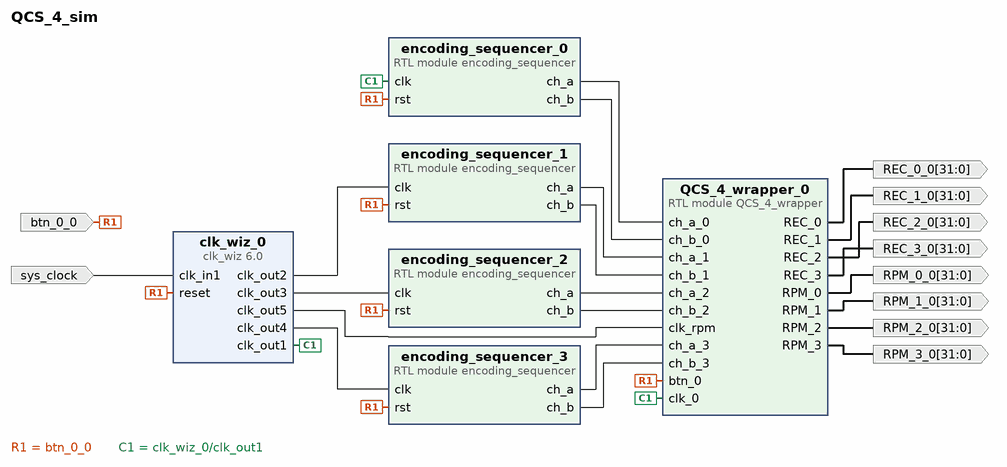
[diagram p0: block diagram of the top level]
# Vivado block design QCS_4_sim, xc7a35ticsg324-1L, Vivado 2023.1
create_bd_design QCS_4_sim

create_bd_port -dir O -from 31 -to 0 REC_0_0
create_bd_port -dir O -from 31 -to 0 REC_1_0
create_bd_port -dir O -from 31 -to 0 REC_2_0
create_bd_port -dir O -from 31 -to 0 REC_3_0
create_bd_port -dir O -from 31 -to 0 RPM_0_0
create_bd_port -dir O -from 31 -to 0 RPM_1_0
create_bd_port -dir O -from 31 -to 0 RPM_2_0
create_bd_port -dir O -from 31 -to 0 RPM_3_0
create_bd_port -dir I -type clk sys_clock
set_property -dict {CONFIG.FREQ_HZ 100000000 CONFIG.PHASE 0.0} [get_bd_ports sys_clock]
create_bd_port -dir I btn_0_0

create_bd_cell -type ip -vlnv xilinx.com:ip:clk_wiz:6.0 clk_wiz_0
set_property -dict [list \
  CONFIG.CLKOUT1_DRIVES BUFG \
  CONFIG.CLKOUT1_JITTER 115.831 \
  CONFIG.CLKOUT1_PHASE_ERROR 87.180 \
  CONFIG.CLKOUT2_DRIVES BUFG \
  CONFIG.CLKOUT2_JITTER 112.035 \
  CONFIG.CLKOUT2_PHASE_ERROR 87.180 \
  CONFIG.CLKOUT2_REQUESTED_OUT_FREQ 120 \
  CONFIG.CLKOUT2_USED true \
  CONFIG.CLKOUT3_DRIVES BUFG \
  CONFIG.CLKOUT3_JITTER 107.567 \
  CONFIG.CLKOUT3_PHASE_ERROR 87.180 \
  CONFIG.CLKOUT3_REQUESTED_OUT_FREQ 150 \
  CONFIG.CLKOUT3_USED true \
  CONFIG.CLKOUT4_DRIVES BUFG \
  CONFIG.CLKOUT4_JITTER 102.086 \
  CONFIG.CLKOUT4_PHASE_ERROR 87.180 \
  CONFIG.CLKOUT4_REQUESTED_OUT_FREQ 200 \
  CONFIG.CLKOUT4_USED true \
  CONFIG.CLKOUT5_DRIVES BUFG \
  CONFIG.CLKOUT5_JITTER 90.074 \
  CONFIG.CLKOUT5_PHASE_ERROR 87.180 \
  CONFIG.CLKOUT5_REQUESTED_OUT_FREQ 400 \
  CONFIG.CLKOUT5_USED true \
  CONFIG.CLKOUT6_DRIVES BUFG \
  CONFIG.CLKOUT7_DRIVES BUFG \
  CONFIG.CLK_IN1_BOARD_INTERFACE sys_clock \
  CONFIG.MMCM_BANDWIDTH OPTIMIZED \
  CONFIG.MMCM_CLKFBOUT_MULT_F 12 \
  CONFIG.MMCM_CLKOUT0_DIVIDE_F 12 \
  CONFIG.MMCM_CLKOUT1_DIVIDE 10 \
  CONFIG.MMCM_CLKOUT2_DIVIDE 8 \
  CONFIG.MMCM_CLKOUT3_DIVIDE 6 \
  CONFIG.MMCM_CLKOUT4_DIVIDE 3 \
  CONFIG.MMCM_COMPENSATION ZHOLD \
  CONFIG.NUM_OUT_CLKS 5 \
  CONFIG.OVERRIDE_MMCM false \
  CONFIG.PRIMITIVE PLL \
  CONFIG.RESET_BOARD_INTERFACE reset \
  CONFIG.RESET_PORT reset \
  CONFIG.RESET_TYPE ACTIVE_HIGH \
  CONFIG.USE_BOARD_FLOW true \
  CONFIG.USE_LOCKED false \
  CONFIG.USE_RESET true \
] [get_bd_cells clk_wiz_0]
create_bd_cell -type module -reference encoding_sequencer encoding_sequencer_0
create_bd_cell -type module -reference encoding_sequencer encoding_sequencer_1
create_bd_cell -type module -reference encoding_sequencer encoding_sequencer_2
create_bd_cell -type module -reference encoding_sequencer encoding_sequencer_3
create_bd_cell -type module -reference QCS_4_wrapper QCS_4_wrapper_0

# ---- connections ----

connect_bd_net [get_bd_pins QCS_4_wrapper_0/REC_0] [get_bd_ports REC_0_0]
connect_bd_net [get_bd_pins QCS_4_wrapper_0/REC_1] [get_bd_ports REC_1_0]
connect_bd_net [get_bd_pins QCS_4_wrapper_0/REC_2] [get_bd_ports REC_2_0]
connect_bd_net [get_bd_pins QCS_4_wrapper_0/REC_3] [get_bd_ports REC_3_0]
connect_bd_net [get_bd_pins QCS_4_wrapper_0/RPM_0] [get_bd_ports RPM_0_0]
connect_bd_net [get_bd_pins QCS_4_wrapper_0/RPM_1] [get_bd_ports RPM_1_0]
connect_bd_net [get_bd_pins QCS_4_wrapper_0/RPM_2] [get_bd_ports RPM_2_0]
connect_bd_net [get_bd_pins QCS_4_wrapper_0/RPM_3] [get_bd_ports RPM_3_0]
connect_bd_net -net btn_0_0_1 [get_bd_ports btn_0_0] \
  [get_bd_pins clk_wiz_0/reset] [get_bd_pins encoding_sequencer_0/rst] [get_bd_pins encoding_sequencer_1/rst] \
  [get_bd_pins encoding_sequencer_2/rst] [get_bd_pins encoding_sequencer_3/rst] [get_bd_pins QCS_4_wrapper_0/btn_0]
connect_bd_net [get_bd_pins clk_wiz_0/clk_out1] [get_bd_pins encoding_sequencer_0/clk] [get_bd_pins QCS_4_wrapper_0/clk_0]
connect_bd_net [get_bd_pins clk_wiz_0/clk_out2] [get_bd_pins encoding_sequencer_1/clk]
connect_bd_net [get_bd_pins clk_wiz_0/clk_out3] [get_bd_pins encoding_sequencer_2/clk]
connect_bd_net [get_bd_pins clk_wiz_0/clk_out4] [get_bd_pins encoding_sequencer_3/clk]
connect_bd_net [get_bd_pins clk_wiz_0/clk_out5] [get_bd_pins QCS_4_wrapper_0/clk_rpm]
connect_bd_net [get_bd_pins encoding_sequencer_0/ch_a] [get_bd_pins QCS_4_wrapper_0/ch_a_0]
connect_bd_net [get_bd_pins encoding_sequencer_0/ch_b] [get_bd_pins QCS_4_wrapper_0/ch_b_0]
connect_bd_net [get_bd_pins encoding_sequencer_1/ch_a] [get_bd_pins QCS_4_wrapper_0/ch_a_1]
connect_bd_net [get_bd_pins encoding_sequencer_1/ch_b] [get_bd_pins QCS_4_wrapper_0/ch_b_1]
connect_bd_net [get_bd_pins encoding_sequencer_2/ch_a] [get_bd_pins QCS_4_wrapper_0/ch_a_2]
connect_bd_net [get_bd_pins encoding_sequencer_2/ch_b] [get_bd_pins QCS_4_wrapper_0/ch_b_2]
connect_bd_net [get_bd_pins encoding_sequencer_3/ch_a] [get_bd_pins QCS_4_wrapper_0/ch_a_3]
connect_bd_net [get_bd_pins encoding_sequencer_3/ch_b] [get_bd_pins QCS_4_wrapper_0/ch_b_3]
connect_bd_net [get_bd_ports sys_clock] [get_bd_pins clk_wiz_0/clk_in1]

validate_bd_design
save_bd_design
